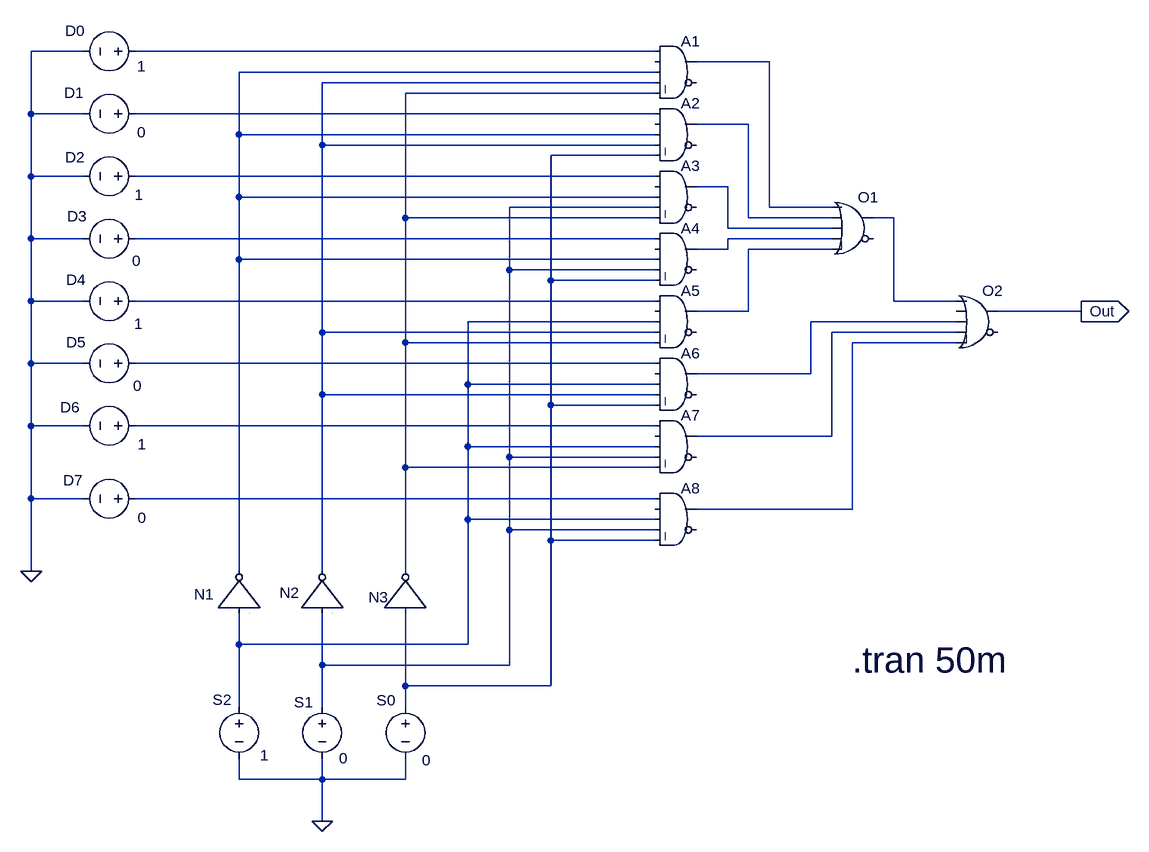
[diagram p0: schematic multiplexer.asc]
multiplexer.asc, the LTspice schematic file:
Version 4
SHEET 1 1420 1268
WIRE -464 -160 -544 -160
WIRE 416 -160 -384 -160
WIRE 592 -144 480 -144
WIRE 416 -128 -224 -128
WIRE 416 -112 -96 -112
WIRE 416 -96 32 -96
WIRE -544 -64 -544 -160
WIRE -464 -64 -544 -64
WIRE 416 -64 -384 -64
WIRE 560 -48 480 -48
WIRE -224 -32 -224 -128
WIRE 416 -32 -224 -32
WIRE -96 -16 -96 -112
WIRE 416 -16 -96 -16
WIRE 416 0 256 0
WIRE -544 32 -544 -64
WIRE -464 32 -544 32
WIRE 416 32 -384 32
WIRE 528 48 480 48
WIRE -224 64 -224 -32
WIRE 416 64 -224 64
WIRE 416 80 192 80
WIRE 592 80 592 -144
WIRE 688 80 592 80
WIRE 32 96 32 -96
WIRE 416 96 32 96
WIRE 560 96 560 -48
WIRE 688 96 560 96
WIRE 784 96 752 96
WIRE 528 112 528 48
WIRE 688 112 528 112
WIRE -544 128 -544 32
WIRE -464 128 -544 128
WIRE 416 128 -384 128
WIRE 688 128 528 128
WIRE 528 144 528 128
WIRE 528 144 480 144
WIRE 688 144 560 144
WIRE -224 160 -224 64
WIRE 416 160 -224 160
WIRE 192 176 192 80
WIRE 416 176 192 176
WIRE 256 192 256 0
WIRE 416 192 256 192
WIRE -544 224 -544 128
WIRE -464 224 -544 224
WIRE 416 224 -384 224
WIRE 784 224 784 96
WIRE 880 224 784 224
WIRE 560 240 560 144
WIRE 560 240 480 240
WIRE 1072 240 944 240
WIRE 416 256 128 256
WIRE 880 256 656 256
WIRE -96 272 -96 -16
WIRE 416 272 -96 272
WIRE 880 272 688 272
WIRE 32 288 32 96
WIRE 416 288 32 288
WIRE 880 288 720 288
WIRE -544 320 -544 224
WIRE -464 320 -544 320
WIRE 416 320 -384 320
WIRE 656 336 656 256
WIRE 656 336 480 336
WIRE 128 352 128 256
WIRE 416 352 128 352
WIRE -96 368 -96 272
WIRE 416 368 -96 368
WIRE 256 384 256 192
WIRE 416 384 256 384
WIRE -544 416 -544 320
WIRE -464 416 -544 416
WIRE 416 416 -384 416
WIRE 688 432 688 272
WIRE 688 432 480 432
WIRE 128 448 128 352
WIRE 416 448 128 448
WIRE 192 464 192 176
WIRE 416 464 192 464
WIRE 32 480 32 288
WIRE 416 480 32 480
WIRE -544 528 -544 416
WIRE -464 528 -544 528
WIRE 416 528 -384 528
WIRE 720 544 720 288
WIRE 720 544 480 544
WIRE 128 560 128 448
WIRE 416 560 128 560
WIRE 192 576 192 464
WIRE 416 576 192 576
WIRE 256 592 256 384
WIRE 416 592 256 592
WIRE -544 640 -544 528
WIRE -224 640 -224 160
WIRE -96 640 -96 368
WIRE 32 640 32 480
WIRE -224 752 -224 704
WIRE 128 752 128 560
WIRE 128 752 -224 752
WIRE -96 784 -96 704
WIRE 192 784 192 576
WIRE 192 784 -96 784
WIRE 32 816 32 704
WIRE 256 816 256 592
WIRE 256 816 32 816
WIRE -224 848 -224 752
WIRE -96 848 -96 784
WIRE 32 848 32 816
WIRE -224 960 -224 928
WIRE -96 960 -96 928
WIRE -96 960 -224 960
WIRE 32 960 32 928
WIRE 32 960 -96 960
WIRE -96 1024 -96 960
FLAG -96 1024 0
FLAG 1072 240 Out
IOPIN 1072 240 Out
FLAG -544 640 0
SYMBOL voltage -224 832 R0
WINDOW 0 -26 21 Bottom 2
WINDOW 3 39 75 Top 2
WINDOW 123 0 0 Left 2
WINDOW 39 0 0 Left 2
SYMATTR InstName S2
SYMATTR Value 1
SYMBOL voltage -96 832 R0
WINDOW 0 -29 25 Bottom 2
WINDOW 3 33 80 Top 2
WINDOW 123 0 0 Left 2
WINDOW 39 0 0 Left 2
SYMATTR InstName S1
SYMATTR Value 0
SYMBOL voltage 32 832 R0
WINDOW 0 -30 22 Bottom 2
WINDOW 3 32 83 Top 2
WINDOW 123 0 0 Left 2
WINDOW 39 0 0 Left 2
SYMATTR InstName S0
SYMATTR Value 0
SYMBOL Digital\\inv -288 704 R270
WINDOW 0 29 -5 VRight 2
SYMATTR InstName N1
SYMBOL Digital\\inv -160 704 R270
WINDOW 0 31 -2 VRight 2
SYMATTR InstName N2
SYMBOL Digital\\inv -32 704 R270
WINDOW 0 24 7 VRight 2
SYMATTR InstName N3
SYMBOL Digital\\and 448 0 R0
SYMATTR InstName A3
SYMBOL Digital\\and 448 96 R0
SYMATTR InstName A4
SYMBOL Digital\\and 448 192 R0
SYMATTR InstName A5
SYMBOL Digital\\and 448 288 R0
SYMATTR InstName A6
SYMBOL Digital\\and 448 384 R0
SYMATTR InstName A7
SYMBOL Digital\\and 448 -96 R0
SYMATTR InstName A2
SYMBOL Digital\\and 448 496 R0
SYMATTR InstName A8
SYMBOL Digital\\and 448 -192 R0
SYMATTR InstName A1
SYMBOL Digital\\or 720 48 R0
SYMATTR InstName O1
SYMBOL Digital\\or 912 192 R0
SYMATTR InstName O2
SYMBOL voltage -368 -160 R90
WINDOW 0 -16 108 VBottom 2
WINDOW 3 7 6 VTop 2
SYMATTR InstName D0
SYMATTR Value 1
SYMBOL voltage -368 -64 R90
WINDOW 0 -17 110 VBottom 2
WINDOW 3 13 6 VTop 2
SYMATTR InstName D1
SYMATTR Value 0
SYMBOL voltage -368 32 R90
WINDOW 0 -14 108 VBottom 2
WINDOW 3 13 10 VTop 2
SYMATTR InstName D2
SYMATTR Value 1
SYMBOL voltage -368 128 R90
WINDOW 0 -19 105 VBottom 2
WINDOW 3 18 14 VTop 2
SYMATTR InstName D3
SYMATTR Value 0
SYMBOL voltage -368 224 R90
WINDOW 0 -17 107 VBottom 2
WINDOW 3 19 11 VTop 2
SYMATTR InstName D4
SYMATTR Value 1
SYMBOL voltage -368 320 R90
WINDOW 0 -17 107 VBottom 2
WINDOW 3 19 12 VTop 2
SYMATTR InstName D5
SYMATTR Value 0
SYMBOL voltage -368 416 R90
WINDOW 0 -13 116 VBottom 2
WINDOW 3 13 5 VTop 2
SYMATTR InstName D6
SYMATTR Value 1
SYMBOL voltage -368 528 R90
WINDOW 0 -13 111 VBottom 2
WINDOW 3 14 5 VTop 2
SYMATTR InstName D7
SYMATTR Value 0
TEXT 720 776 Left 5 !.tran 50m

The netlist it stands for:
* multiplexer.asc
V§S2 N017 0 1
V§S1 N011 0 0
V§S0 N008 0 0
A§N1 N017 0 0 0 0 N003 0 0 BUF
A§N2 N011 0 0 0 0 N004 0 0 BUF
A§N3 N008 0 0 0 0 N005 0 0 BUF
A3 N009 0 N003 N011 N005 0 N010 0 AND
A4 N013 0 N003 N011 N008 0 N014 0 AND
A5 N016 0 N017 N004 N005 0 N015 0 AND
A6 N021 0 N017 N004 N008 0 N018 0 AND
A7 N022 0 N017 N011 N005 0 N019 0 AND
A2 N006 0 N003 N004 N008 0 N007 0 AND
A8 N023 0 N017 N011 N008 0 N020 0 AND
A1 N001 0 N003 N004 N005 0 N002 0 AND
A§O1 N002 N007 N010 N014 N015 0 N012 0 OR
A§O2 N012 0 N018 N019 N020 0 Out 0 OR
V§D0 N001 0 1
V§D1 N006 0 0
V§D2 N009 0 1
V§D3 N013 0 0
V§D4 N016 0 1
V§D5 N021 0 0
V§D6 N022 0 1
V§D7 N023 0 0
.tran 50m
.backanno
.end